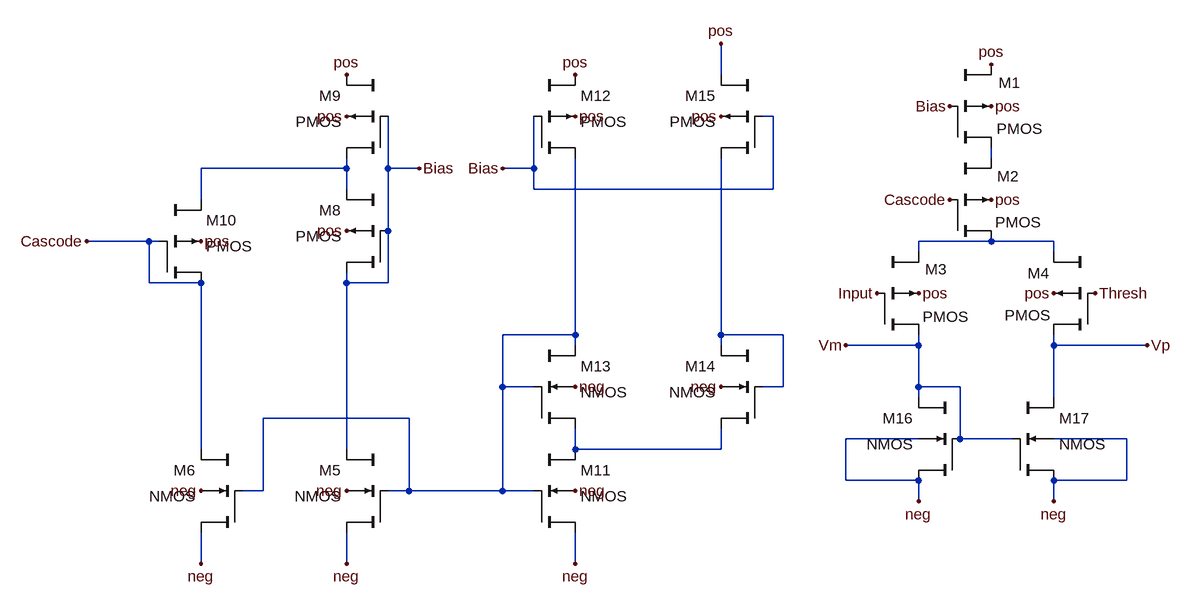
[diagram p0: schematic comparator_preamp.asc]
comparator_preamp.asc, the LTspice schematic file:
Version 4
SHEET 1 1144 1268
WIRE -864 -32 -864 -80
WIRE -784 32 -800 32
WIRE -448 96 -448 80
WIRE -1440 112 -1440 96
WIRE -1440 112 -1664 112
WIRE -1376 112 -1376 32
WIRE -1328 112 -1376 112
WIRE -1152 112 -1152 32
WIRE -1152 112 -1200 112
WIRE -1440 144 -1440 112
WIRE -1152 144 -1152 112
WIRE -784 144 -784 32
WIRE -784 144 -1152 144
WIRE -1664 160 -1664 112
WIRE -1376 208 -1376 112
WIRE -1744 224 -1840 224
WIRE -1728 224 -1744 224
WIRE -448 224 -560 224
WIRE -352 224 -448 224
WIRE -560 240 -560 224
WIRE -352 240 -352 224
WIRE -1744 288 -1744 224
WIRE -1664 288 -1744 288
WIRE -1440 288 -1440 272
WIRE -1376 288 -1376 208
WIRE -1376 288 -1440 288
WIRE -1088 368 -1088 96
WIRE -1088 368 -1200 368
WIRE -864 368 -864 96
WIRE -768 368 -864 368
WIRE -1088 384 -1088 368
WIRE -864 384 -864 368
WIRE -560 384 -560 368
WIRE -560 384 -672 384
WIRE -352 384 -352 368
WIRE -208 384 -352 384
WIRE -1200 448 -1200 368
WIRE -1152 448 -1200 448
WIRE -768 448 -768 368
WIRE -768 448 -800 448
WIRE -560 448 -560 384
WIRE -496 448 -560 448
WIRE -560 464 -560 448
WIRE -352 464 -352 384
WIRE -1344 496 -1568 496
WIRE -560 528 -672 528
WIRE -496 528 -496 448
WIRE -416 528 -496 528
WIRE -240 528 -352 528
WIRE -1664 544 -1664 288
WIRE -1440 544 -1440 288
WIRE -1088 544 -1088 512
WIRE -864 544 -864 512
WIRE -864 544 -1088 544
WIRE -672 592 -672 528
WIRE -560 592 -672 592
WIRE -240 592 -240 528
WIRE -240 592 -352 592
WIRE -1568 608 -1568 496
WIRE -1568 608 -1600 608
WIRE -1344 608 -1344 496
WIRE -1344 608 -1376 608
WIRE -1200 608 -1200 448
WIRE -1200 608 -1344 608
WIRE -1152 608 -1200 608
WIRE -560 624 -560 592
WIRE -352 624 -352 592
WIRE -1664 720 -1664 672
WIRE -1440 720 -1440 672
WIRE -1088 720 -1088 672
FLAG -560 304 pos
FLAG -352 304 pos
FLAG -448 160 pos
FLAG -448 16 pos
FLAG -448 -48 pos
FLAG -624 304 Input
FLAG -288 304 Thresh
FLAG -512 160 Cascode
FLAG -512 16 Bias
FLAG -208 384 Vp
FLAG -672 384 Vm
FLAG -1440 608 neg
FLAG -1664 608 neg
FLAG -1440 720 neg
FLAG -1664 720 neg
FLAG -1440 208 pos
FLAG -1440 32 pos
FLAG -1440 -32 pos
FLAG -1664 224 pos
FLAG -1840 224 Cascode
FLAG -1328 112 Bias
FLAG -1088 608 neg
FLAG -1088 720 neg
FLAG -1088 32 pos
FLAG -1088 -32 pos
FLAG -1200 112 Bias
FLAG -1088 448 neg
FLAG -864 448 neg
FLAG -864 32 pos
FLAG -864 -80 pos
FLAG -560 624 neg
FLAG -352 624 neg
SYMBOL cktsym\\pmos4 -448 16 R0
WINDOW 0 11 -36 Left 2
WINDOW 3 8 35 Left 2
SYMATTR InstName M1
SYMATTR Value2 l=4u w=16u
SYMBOL cktsym\\pmos4 -448 160 R0
WINDOW 0 9 -36 Left 2
WINDOW 3 6 35 Left 2
SYMATTR InstName M2
SYMATTR Value2 l=.8u w=3.2u
SYMBOL cktsym\\pmos4 -560 304 R0
WINDOW 0 10 -37 Left 2
WINDOW 3 6 36 Left 2
SYMATTR InstName M3
SYMATTR Value2 l=1u w=3u
SYMBOL cktsym\\pmos4 -352 304 M0
WINDOW 0 6 -31 Left 2
WINDOW 3 5 34 Left 2
SYMATTR InstName M4
SYMATTR Value2 l=1u w=3u
SYMBOL cktsym\\nmos4 -1440 608 M0
SYMATTR InstName M5
SYMATTR Value2 l=4u w=0.9u
SYMBOL cktsym\\nmos4 -1664 608 M0
SYMATTR InstName M6
SYMATTR Value2 l=4u w=4u
SYMBOL cktsym\\pmos4 -1440 208 M0
SYMATTR InstName M8
SYMATTR Value2 l=1u w=16u
SYMBOL cktsym\\pmos4 -1440 32 M0
SYMATTR InstName M9
SYMATTR Value2 l=4u w=16u
SYMBOL cktsym\\pmos4 -1664 224 R0
SYMATTR InstName M10
SYMATTR Value2 l=4u w=16u
SYMBOL cktsym\\nmos4 -1088 608 R0
SYMATTR InstName M11
SYMATTR Value2 l=4u w=4u
SYMBOL cktsym\\pmos4 -1088 32 R0
SYMATTR InstName M12
SYMATTR Value2 l=4u w=3.2u
SYMBOL cktsym\\nmos4 -1088 448 R0
SYMATTR InstName M13
SYMATTR Value2 l=4u w=16u
SYMBOL cktsym\\nmos4 -864 448 M0
SYMATTR InstName M14
SYMATTR Value2 l=4u w=4u
SYMBOL cktsym\\pmos4 -864 32 M0
SYMATTR InstName M15
SYMATTR Value2 l=4u w=16u
SYMBOL cktsym\\nmos4 -560 528 M0
SYMATTR InstName M16
SYMATTR Value2 l=0.9u w=3u
SYMBOL cktsym\\nmos4 -352 528 R0
SYMATTR InstName M17
SYMATTR Value2 l=0.9u w=3u

The netlist it stands for:
* comparator_preamp.asc
M1 N001 Bias pos pos PMOS l=4u w=16u
M2 N003 Cascode N001 pos PMOS l=.8u w=3.2u
M3 Vm Input N003 pos PMOS l=1u w=3u
M4 Vp Thresh N003 pos PMOS l=1u w=3u
M5 Bias N004 neg neg NMOS l=4u w=0.9u
M6 Cascode N004 neg neg NMOS l=4u w=4u
M8 Bias Bias N002 pos PMOS l=1u w=16u
M9 N002 Bias pos pos PMOS l=4u w=16u
M10 Cascode Cascode N002 pos PMOS l=4u w=16u
M11 N006 N004 neg neg NMOS l=4u w=4u
M12 N004 Bias pos pos PMOS l=4u w=3.2u
M13 N004 N004 N006 neg NMOS l=4u w=16u
M14 N005 N005 N006 neg NMOS l=4u w=4u
M15 N005 Bias pos pos PMOS l=4u w=16u
M16 Vm Vm neg neg NMOS l=0.9u w=3u
M17 Vp Vm neg neg NMOS l=0.9u w=3u
.model NMOS NMOS
.model PMOS PMOS
.lib standard.mos
.backanno
.end